# Altium schematic sheet CAN.SchDoc
size A4
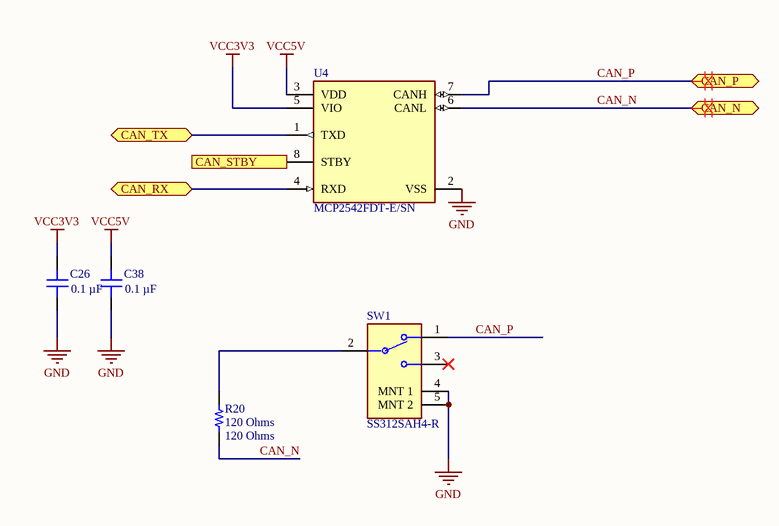
[diagram p0: CAN.SchDoc]

## Parts
C26  0.1 µF  [CAP 0805_2012]
C38  0.1 µF  [CAP 0805_2012]
R20  120 Ohms  [RES 0805_2012]
SW1  SS312SAH4-R  [FP-SS312SAH4-R-MFG]
U4  MCP2542FDT-E/SN  [FP-C04-057-SN-IPC_C]

## Ports
CAN_N (bidir), CAN_P (bidir), CAN_RX (bidir), CAN_STBY (in), CAN_TX (bidir)

## Nets
GND: C26.1 C38.1 SW1.4(MNT_1) SW1.5(MNT_2) U4.2(VSS)
VCC3V3: C26.2 U4.5(VIO)
VCC5V: C38.2 U4.3(VDD)
CAN_N: R20.1 U4.6(CANL) ; port CAN_N
CAN_P: SW1.1 U4.7(CANH) ; port CAN_P
CAN_RX: U4.4(RXD) ; port CAN_RX
CAN_STBY: U4.8(STBY) ; port CAN_STBY
CAN_TX: U4.1(TXD) ; port CAN_TX
NetR20_2: R20.2 SW1.2(COM)

Not connected (* = marked no-connect by the designer): SW1 3*

## Layout directives
differential pair: CAN_N, CAN_P

## Library data of the parts
C26 C38 = CC0805MRX7R9BB104: CAP CER 0.1UF 50V X7R 0805; manufacturer: Yageo; Tolerance: ±20%; Part Number: CC0805MRX7R9BB104; Value: 0.1 µF; Applications: General Purpose; Capacitance: 0.1 µF; componentlink1description: Datasheet; componentlink1url: https://www.yageo.com/upload/media/product/productsearch/datasheet/mlcc/UPY-GPHC_X7R_6.3V-to-50V_18.pdf; componentlink2description: DigiKey Link; componentlink2url: https://www.digikey.com/en/products/detail/yageo/CC0805MRX7R9BB104/5884281; Device Package: 0805 (2012 Metric); lastupdated: 2023-10-12 7:14:35 PM; Lifecycle Status: Active; Minimum Order: 1; Mounting Type: Surface Mount, MLCC; Operating Temperature: -55°C ~ 125°C; Package / Case: 0805 (2012 Metric); packaging: TapeAndReel; partid: 2475; Part Status: Active; price: 0.01; series: CC; Size / Dimension: 0.079" L x 0.049" W (2.00mm x 1.25mm); Supplier 1: DigiKey; Supplier Part Number 1: 311-4351-1-ND; Temperature Coefficient: X7R; Thickness (Max): 0.037" (0.95mm); Voltage - Rated: 50V
R20 = ERJ-6ENF1200V: RES SMD 120 OHM 1% 1/8W 0805; Part Number: ERJ-6ENF1200V; Value: 120 Ohms
SW1 = CMP-31746-000001-1: SWITCH SLIDE SPDT 0.4VA 28V; Mechanical Life: 10000Cycles; Switch Function: On-On; Actuator Length: 2mm; Contact Style: Shorting; Max Current Rating: 100mA; Actuator Type: Standard; Actuator Material: Polyphenylene; Length: 10.5mm; Orientation: Right Angle; Voltage Rating (DC): 28V; Contact Material: Bronze; Electrical Life: 10000Cycles; Max Operating Temperature: 85°C; Case/Package: SMD/SMT; Depth: 7.45mm; Contact Plating: Gold; Voltage Rating (AC): 28V; Package Quantity: 1; Min Operating Temperature: -25°C; Switch Travel: 2mm; Housing Material: Bronze; RoHS Compliant: Yes; Lead Free: Lead Free; Termination: Gull Wing; Packaging: Tape and Reel; REACH SVHC: No SVHC; Mount: Surface Mount; Series: SS3; Throw Configuration: SPDT; Max Voltage Rating (AC): 28V; Max Voltage Rating (DC): 28V
U4 = CMP-06279-000006-1: IC TRANSCEIVER 1/1 8SOIC; Data Rate: 8Mbps; Receiver Hysteresis: 200mV; Min Operating Temperature: -40°C; Mount: Surface Mount; Case/Package: SOIC; Max Operating Temperature: 125°C; Packaging: Rail/Tube